# EAGLE design zerocam2S_revC (EAGLE 9.6.1)
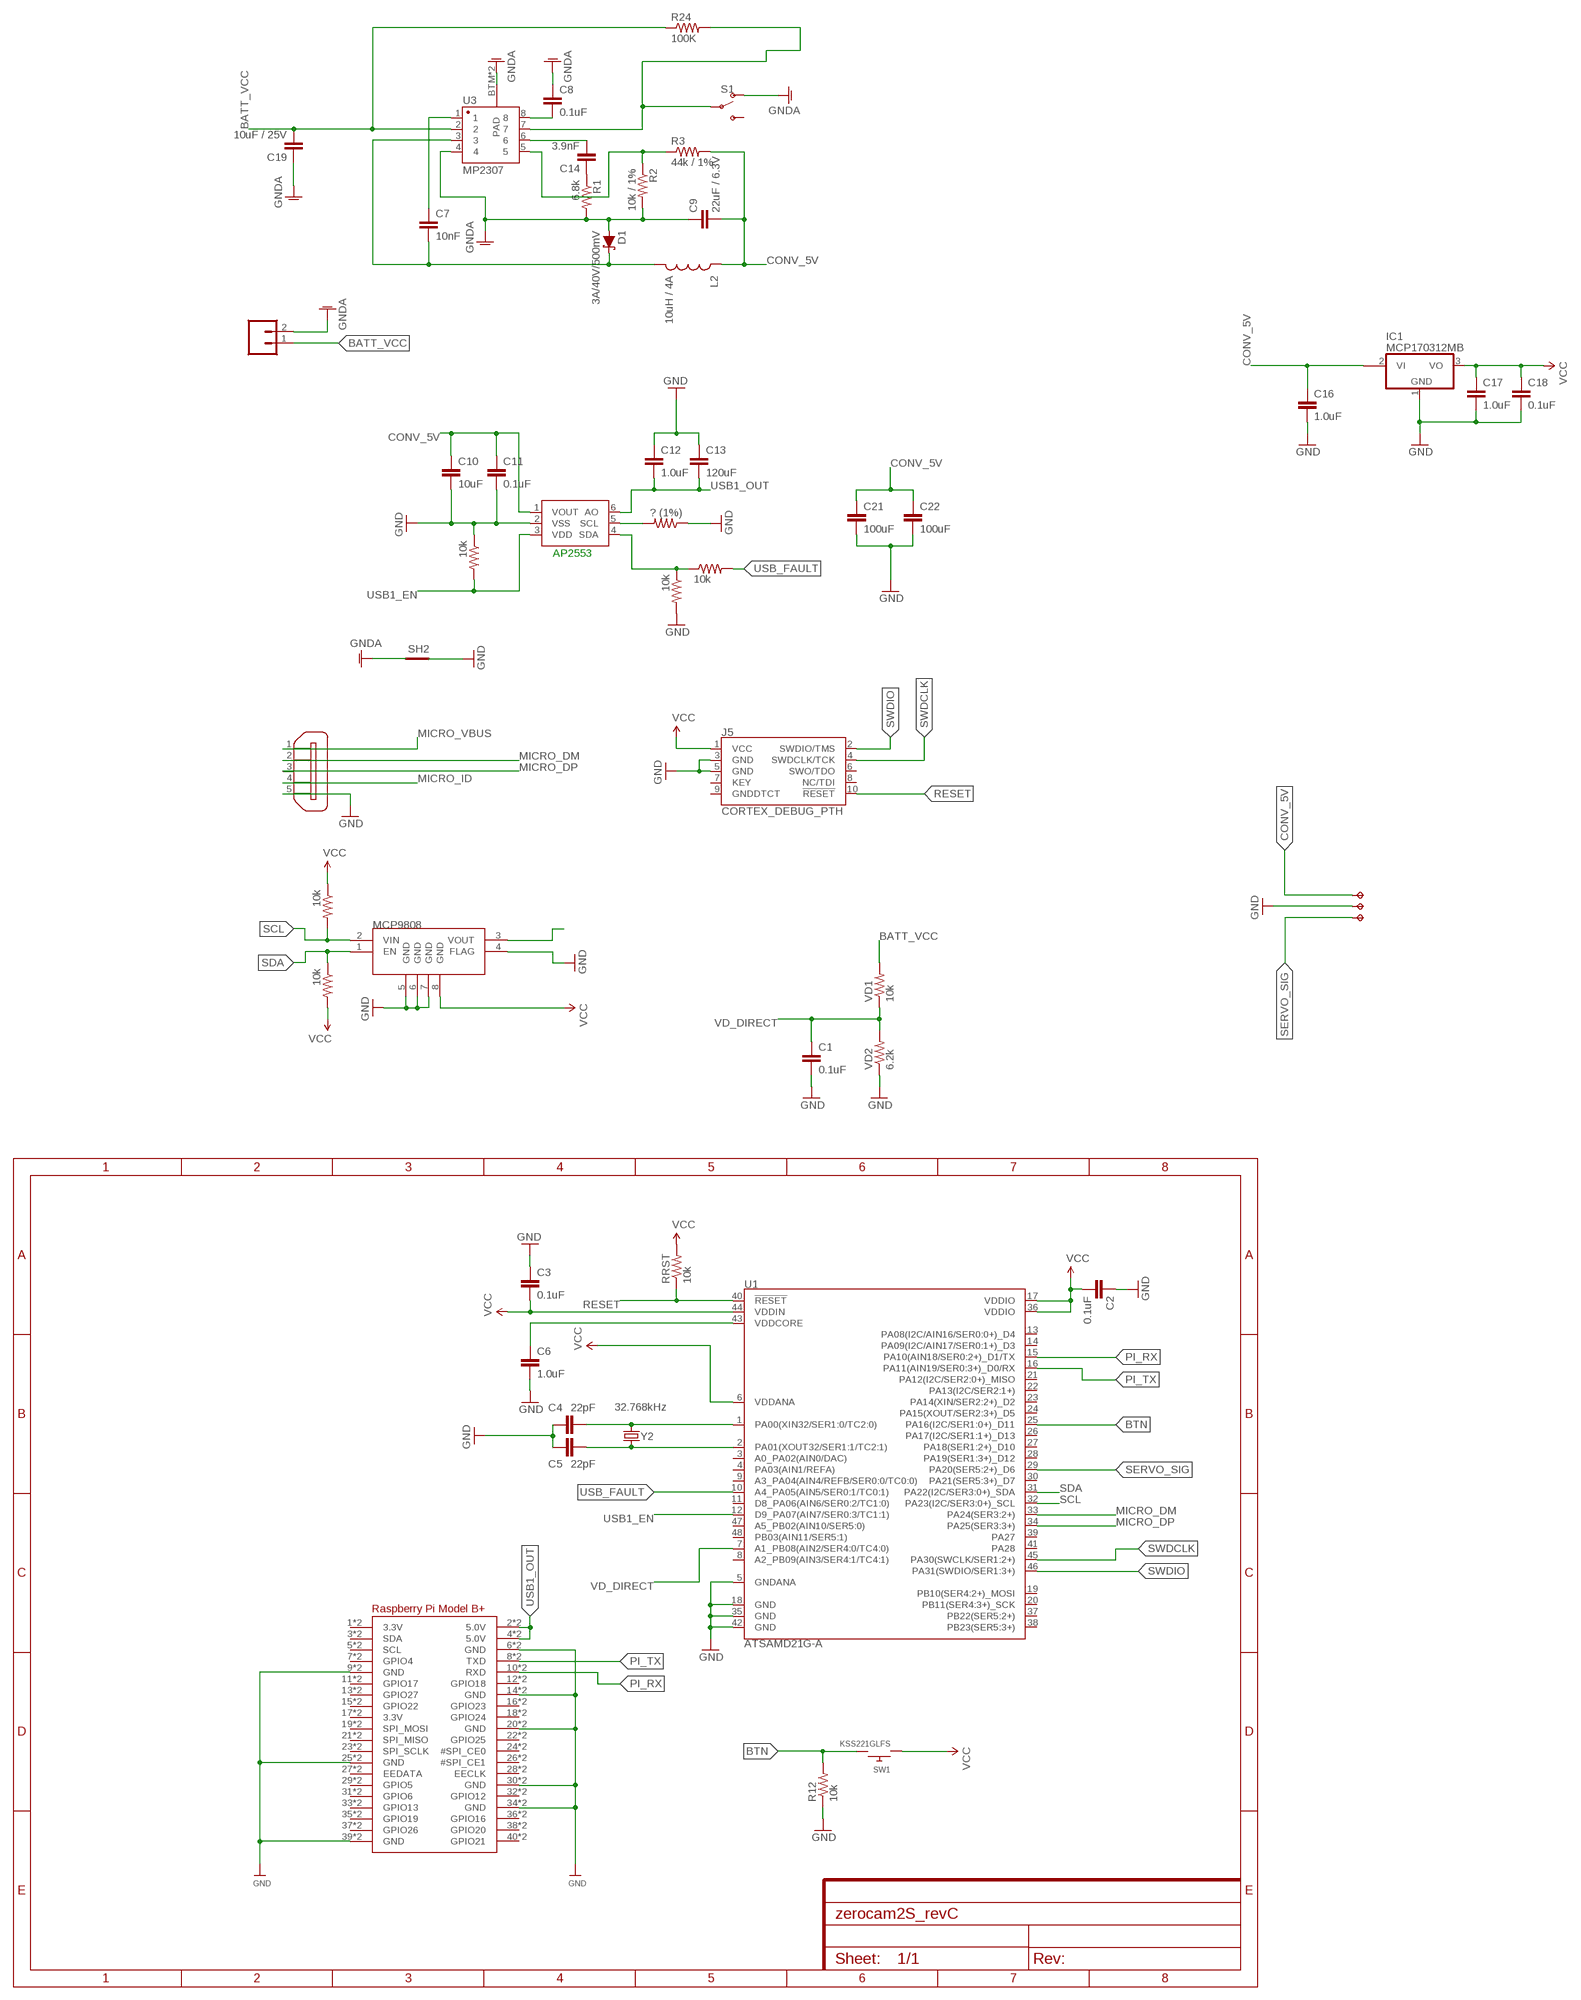
[diagram p0: schematic, sheet 1]

## Parts
AP2553  MCP4725  MCP4725SOT-23  [SOT23-6]
C1  0.1uF  CAP0805  [0805]
C2  0.1uF  1.0UF-0805-25V-10%  [0805]
C3  0.1uF  1.0UF-0805-25V-10%  [0805]
C4  22pF  CAP0805  [0805]
C5  22pF  CAP0805  [0805]
C6  1.0uF  1.0UF-0805-25V-10%  [0805]
C7  10nF  CAP0805  [0805]
C8  0.1uF  CAP1206  [1206]
C9  22uF / 6.3V  CAP1210  [1210]
C10  10uF  1.0UF-0805-25V-10%  [0805]
C11  0.1uF  1.0UF-0805-25V-10%  [0805]
C12  1.0uF  1.0UF-1206-50V-10%  [1206]
C13  120uF  1.0UF-1206-50V-10%  [1206]
C14  3.9nF  CAP1206  [1206]
C16  1.0uF  1.0UF-0805-25V-10%  [0805]
C17  1.0uF  1.0UF-1206-50V-10%  [1206]
C18  0.1uF  1.0UF-0805-25V-10%  [0805]
C19  10uF / 25V  CAP1210  [1210]
C21  100uF  10UF-1210-50V-20%  [1210]
C22  100uF  10UF-1210-50V-20%  [1210]
D1  3A/40V/500mV  DIODE-SCHOTTKY-B340A  [SMA-DIODE]
IC1  MCP170312MB  [SOT89]
J1  CONN_023.5MM-NO_SILK  [SCREWTERMINAL-3.5MM-2-NS]
J5  CORTEX_DEBUG_PTH  [2X5-PTH-1.27MM]
L2  10uH / 4A  INDUCTORSRU1038  [SRU1038]
MCP9808  V_REG_MIC5216  [MSOP8]
R1  6.8k  RESISTOR1206  [1206]
R2  10k / 1%  RESISTOR1206  [1206]
R3  44k / 1%  RESISTOR1206  [1206]
R12  10k  RESISTOR0805-RES  [0805]
R24  100K  RESISTOR1206  [1206]
R_I2C_1  10k  RESISTOR0805-RES  [0805]
R_I2C_2  10k  RESISTOR0805-RES  [0805]
R_MOSFET_USB1  ? (1%)  RESISTOR0805-RES  [0805]
R_MOSFET_USB2  10k  RESISTOR0805-RES  [0805]
R_MOSFET_USB3  10k  RESISTOR0805-RES  [0805]
R_MOSFET_USB4  10k  RESISTOR0805-RES  [0805]
RPI1  RASPBERRYPI_BPLUS_BONNET_THMSMT  [PI_BONNET_THMSMT]
RRST  10k  RESISTOR0805-RES  [0805]
S1  SWITCH-SPDT-SMD-RIGHT-ANGLE  [SWITCH_SPST_SMD_A]
SH2  SHORT-HT5  [SHORT_TOP-50]
SW1  KSS221GLFS  SWITCH_PUSHBUTTONC&K_KSS  [BTN_CK_KSS]
TP1  TPTP20SQ  [TP20SQ]
TP2  TPTP20SQ  [TP20SQ]
TP3  TPTP20SQ  [TP20SQ]
U1  ATSAMD21G-A  [TQFP-48]
U3  MP2307  GENERIC-SOIC8MSGEQ7N-FILTER  [SO08]
VD1  10k  RESISTOR0805-RES  [0805]
VD2  6.2k  RESISTOR0805-RES  [0805]
X2  ZX62D-B-5PA8  [ZX62D-B-5PA8]
Y2  32.768kHz  CRYSTAL3.2X1.5MM  [CRYSTAL-SMD-3.2X1.5MM]

## Nets
BATT_VCC: C19.2 J1.1 R24.1 U3.2 VD1.2
BTN: R12.2 SW1.P$2 U1.25(PA16(I2C/SER1:0+)_D11)
CONV_5V [power]: AP2553.1(VOUT) C9.2 C10.1 C11.1 C16.1 C21.1 C22.1 IC1.2@1(VI1) L2.1 R3.2 TP1.TP
GND: AP2553.2(VSS) C1.2 C2.1 C3.1 C4.1 C5.1 C6.2 C10.2 C11.2 C12.1 C13.1 C16.2 C17.2 C18.2 C21.2 C22.2 IC1.1(GND) J5.3(GND) J5.5(GND) MCP9808.4(FLAG) MCP9808.5(GND) MCP9808.6(GND) MCP9808.7(GND) R12.1 R_MOSFET_USB1.1 R_MOSFET_USB2.2 R_MOSFET_USB3.1 RPI1.6(GND) RPI1.9(GND) RPI1.14(GND) RPI1.20(GND) RPI1.25(GND) RPI1.30(GND) RPI1.34(GND) RPI1.39(GND) RPI1.S6(GND) RPI1.S9(GND) RPI1.S14(GND) RPI1.S20(GND) RPI1.S25(GND) RPI1.S30(GND) RPI1.S34(GND) RPI1.S39(GND) SH2.2 TP2.TP U1.5(GNDANA) U1.18(GND) U1.35(GND) U1.42(GND) VD2.1 X2.5
GNDA [power]: C8.1 C9.1 C19.1 D1.A J1.2 R1.2 R2.2 S1.1(O) SH2.1 U3.4 U3.BTM(PAD) U3.P$1(PAD)
MICRO_DM: U1.33(PA24(SER3:2+)) X2.2
MICRO_DP: U1.34(PA25(SER3:3+)) X2.3
MICRO_ID: X2.4
MICRO_VBUS: X2.1
N$1: C6.1 U1.43(VDDCORE)
N$3: AP2553.5(SCL) R_MOSFET_USB1.2
N$4: MCP9808.3(VOUT)
N$5: AP2553.4(SDA) R_MOSFET_USB2.1 R_MOSFET_USB4.1
N$8: C4.2 U1.1(PA00(XIN32/SER1:0/TC2:0)) Y2.P$2
N$25: C8.2 U3.8
N$26 [power]: C7.2 D1.C L2.2 U3.3
N$27: C7.1 U3.1
N$28: C14.1 R1.1
N$29: C14.2 U3.6
N$30: R2.1 R3.1 U3.5
N$32: C5.2 U1.2(PA01(XOUT32/SER1:1/TC2:1)) Y2.P$1
PB_BUCK_EN: R24.2 S1.2(P) U3.7
PI_RX: RPI1.10(RXD) RPI1.S10(RXD) U1.15(PA10(AIN18/SER0:2+)_D1/TX)
PI_TX: RPI1.8(TXD) RPI1.S8(TXD) U1.16(PA11(AIN19/SER0:3+)_D0/RX)
RESET: J5.10(!RESET) RRST.1 U1.40(!RESET!)
SCL: MCP9808.2(VIN) R_I2C_1.2 U1.32(PA23(I2C/SER3:0+)_SCL)
SDA: MCP9808.1(EN) R_I2C_2.1 U1.31(PA22(I2C/SER3:0+)_SDA)
SERVO_SIG: TP3.TP U1.29(PA20(SER5:2+)_D6)
SWDCLK: J5.4(SWDCLK/TCK) U1.45(PA30(SWCLK/SER1:2+))
SWDIO: J5.2(SWDIO/TMS) U1.46(PA31(SWDIO/SER1:3+))
USB1_EN: AP2553.3(VDD) R_MOSFET_USB3.2 U1.12(D9_PA07(AIN7/SER0:3/TC1:1))
USB1_OUT: AP2553.6(AO) C12.2 C13.2 RPI1.2(5.0V) RPI1.4(5.0V) RPI1.S2(5.0V) RPI1.S4(5.0V)
USB_FAULT: R_MOSFET_USB4.2 U1.10(A4_PA05(AIN5/SER0:1/TC0:1))
VCC [power]: C2.2 C3.2 C17.1 C18.1 IC1.3(VO) J5.1(VCC) MCP9808.8(GND) R_I2C_1.1 R_I2C_2.2 RRST.2 SW1.P$1 U1.6(VDDANA) U1.17(VDDIO) U1.36(VDDIO) U1.44(VDDIN)
VD_DIRECT: C1.1 U1.7(A1_PB08(AIN2/SER4:0/TC4:0)) VD1.1 VD2.2
Unconnected: IC1.2(VI) J5.6(SWO/TDO) J5.7(KEY) J5.8(NC/TDI) J5.9(GNDDTCT) RPI1.1(3.3V) RPI1.3(SDA) RPI1.5(SCL) RPI1.7(GPIO4) RPI1.11(GPIO17) RPI1.12(GPIO18) RPI1.13(GPIO27) RPI1.15(GPIO22) RPI1.16(GPIO23) RPI1.17(3.3V) RPI1.18(GPIO24) RPI1.19(SPI_MOSI) RPI1.21(SPI_MISO) RPI1.22(GPIO25) RPI1.23(SPI_SCLK) RPI1.24(#SPI_CE0) RPI1.26(#SPI_CE1) RPI1.27(EEDATA) RPI1.28(EECLK) RPI1.29(GPIO5) RPI1.31(GPIO6) RPI1.32(GPIO12) RPI1.33(GPIO13) RPI1.35(GPIO19) RPI1.36(GPIO16) RPI1.37(GPIO26) RPI1.38(GPIO20) RPI1.40(GPIO21) RPI1.S1(3.3V) RPI1.S3(SDA) RPI1.S5(SCL) RPI1.S7(GPIO4) RPI1.S11(GPIO17) RPI1.S12(GPIO18) RPI1.S13(GPIO27) RPI1.S15(GPIO22) RPI1.S16(GPIO23) RPI1.S17(3.3V) RPI1.S18(GPIO24) RPI1.S19(SPI_MOSI) RPI1.S21(SPI_MISO) RPI1.S22(GPIO25) RPI1.S23(SPI_SCLK) RPI1.S24(#SPI_CE0) RPI1.S26(#SPI_CE1) RPI1.S27(EEDATA) RPI1.S28(EECLK) RPI1.S29(GPIO5) RPI1.S31(GPIO6) RPI1.S32(GPIO12) RPI1.S33(GPIO13) RPI1.S35(GPIO19) RPI1.S36(GPIO16) RPI1.S37(GPIO26) RPI1.S38(GPIO20) RPI1.S40(GPIO21) S1.3(S) U1.3(A0_PA02(AIN0/DAC)) U1.4(PA03(AIN1/REFA)) U1.8(A2_PB09(AIN3/SER4:1/TC4:1)) U1.9(A3_PA04(AIN4/REFB/SER0:0/TC0:0)) U1.11(D8_PA06(AIN6/SER0:2/TC1:0)) U1.13(PA08(I2C/AIN16/SER0:0+)_D4) U1.14(PA09(I2C/AIN17/SER0:1+)_D3) U1.19(PB10(SER4:2+)_MOSI) U1.20(PB11(SER4:3+)_SCK) U1.21(PA12(I2C/SER2:0+)_MISO) U1.22(PA13(I2C/SER2:1+)) U1.23(PA14(XIN/SER2:2+)_D2) U1.24(PA15(XOUT/SER2:3+)_D5) U1.26(PA17(I2C/SER1:1+)_D13) U1.27(PA18(SER1:2+)_D10) U1.28(PA19(SER1:3+)_D12) U1.30(PA21(SER5:3+)_D7) U1.37(PB22(SER5:2+)) U1.38(PB23(SER5:3+)) U1.39(PA27) U1.41(PA28) U1.47(A5_PB02(AIN10/SER5:0)) U1.48(PB03(AIN11/SER5:1)) X2.S1 X2.S2 X2.S3 X2.S4

## Notes on the sheet
- AP2553

## Library data of the parts
AP2553 = SparkFun-IC-Conversion:MCP4725: MCP4725 DAC Microchip 12-bit I2C DAC, SOT23-6 Datasheet <https://cdn.sparkfun.com/datasheets/BreakoutBoards/MCP4725_2009.pdf> SparkFun Products SparkFun I2C DAC Breakout - MCP4725 <https://www.sparkfun.com/products/12918> (BOB-12918); PROD_ID: IC-08886
C1 C7-C9 C14 C19 = SparkFun-Capacitors:CAP: Capacitor Standard 0603 ceramic capacitor, and 0.1" leaded capacitor.
C2 C3 C10 C11 C18 = SparkFun-Capacitors:1.0UF: 1µF ceramic capacitors A capacitor is a passive two-terminal electrical component used to store electrical energy temporarily in an electric field.; PROD_ID: CAP-08064; VALUE: 1.0uF
C4 C5 = SparkFun-Passives:CAP: Capacitor Standard 0603 ceramic capacitor, and 0.1" leaded capacitor.
C6 C16 = SparkFun-Capacitors:1.0UF: 1µF ceramic capacitors A capacitor is a passive two-terminal electrical component used to store electrical energy temporarily in an electric field.; PROD_ID: CAP-08064
C12 C17 = SparkFun-Capacitors:1.0UF: 1µF ceramic capacitors A capacitor is a passive two-terminal electrical component used to store electrical energy temporarily in an electric field.; PROD_ID: CAP-09822
C13 = SparkFun-Capacitors:1.0UF: 1µF ceramic capacitors A capacitor is a passive two-terminal electrical component used to store electrical energy temporarily in an electric field.; PROD_ID: CAP-09822; VALUE: 1.0uF
C21 C22 = SparkFun-Capacitors:10UF: 10.0µF ceramic capacitors A capacitor is a passive two-terminal electrical component used to store electrical energy temporarily in an electric field.; PROD_ID: CAP-09824; VALUE: 10uF
D1 = SparkFun-DiscreteSemi:DIODE-SCHOTTKY: Schottky diode A Schottky diode is a semiconductor diode which has a low forward voltage drop and a very fast switching action.; PROD_ID: DIO-09886
IC1 = linear:MCP1703*: 250 mA, 16V, Low Quiescent Current LDO Regulator Source: http://ww1.microchip.com/downloads/en/DeviceDoc/22049b.pdf
J1 = SparkFun-Connectors:CONN_02: Multi connection point. Often used as Generic Header-pin footprint for 0.1 inch spaced/style header connections On any of the 0.1 inch spaced packages, you can populate with these: Break Away Headers - Straight <https://www.sparkfun.com/products/116> (PRT-00116) Break Away Male Headers - Right Angle <https://www.sparkfun.com/products/553> (PRT-00553) Female Headers <https://www.sparkfun.com/products/115> (PRT-00115) Break Away Headers - Machine Pin <https://www.sparkfun.com/products/117> (PRT-00117) Break Away Female Headers - Swiss Machine Pin <https://www.sparkfun.com/products/743> (PRT-00743) For SCREWTERMINALS and SPRING TERMINALS visit here: Screw Terimnals on SparkFun.com <https://www.sparkfun.com/search/results?term=Screw+Terminals> (5mm/3.5mm/2.54mm spacing) This device is also useful as a general connection point to wire up your design to another part of your project. Our various solder wires solder well into these plated through hole pads. Hook-Up Wire - Assortment (Stranded, 22 AWG) <https://www.sparkfun.com/products/11375> (PRT-11375) Hook-Up Wire - Assortment (Solid Core, 22 AWG) <https://www.sparkfun.com/products/11367> (PRT-11367) View the entire wire category on our website here <https://www.sparkfun.com/categories/141> Special notes: Molex polarized connector foot print use with: PRT-08233 with associated crimp pins and housings. 2.54_SCREWTERM for use with PRT-10571. 3.5mm Screw Terminal footprints for PRT-08084 5mm Screw Terminal footprints for use with PRT-08432; PROD_ID: CONN-08399
J5 = SparkFun-Connectors:CORTEX_DEBUG: Cortex Debug Connector - 10 pin Supports JTAG debug, Serial Wire debug, and Serial Wire Viewer. PTH and SMD connector options available. General Connector Information <http://infocenter.arm.com/help/topic/com.arm.doc.faqs/attached/13634/cortex_debug_connectors.pdf> Products: PTH Connector <http://www.digikey.com/product-detail/en/cnc-tech/3220-10-0100-00/1175-1627-ND/3883661> -via Digi-Key SparkFun PSoc <https://www.sparkfun.com/products/13229> SparkFun T <https://www.sparkfun.com/products/13810>
L2 = SparkFun-Passives:INDUCTOR: Inductors Basic Inductor/Choke - 0603 and 1206. Footprints are not proven and vary greatly between part numbers. INDUCTOR POWER 3.3UH 4.0A SMD 0.197" L x 0.197" W x 0.177" H (5.00mm x 5.00mm x 4.50mm)
MCP9808 = SparkFun-IC-Power:V_REG_MIC5216: 500mA LDO, MSOP8 for better dissipation; PROD_ID: IC-09527
R1-R3 R24 = SparkFun-Resistors:RESISTOR: Resistor Basic schematic elements and footprints for 0603, 1206, and PTH resistors.
R12 R_I2C_1 R_I2C_2 R_MOSFET_USB1-R_MOSFET_USB4 RRST VD1 VD2 = SparkFun-Passives:RESISTOR: Resistor Basic schematic elements and footprints for 0603, 1206, and PTH resistors.
RPI1 = microbuilder:RASPBERRYPI_BPLUS
S1 = SparkFun-Switches:SWITCH-SPDT: Single Pole, Double Throw (SPDT) Switch Single-pole, double-throw (SPDT) switch. Variant Overview SMD-AYZ0202 Surface Mount DPDT Switch <https://www.sparkfun.com/products/597> (COM-00597) Used on e.g. LilyPad Arduino USB - ATmega32U4 Board <https://www.sparkfun.com/products/12049> PTH-11.6X4.0MM SPDT Mini Power Switch <https://www.sparkfun.com/products/102> (COM-00102) Used on e.g. SparkFun Simon Says - Through-Hole Soldering Kit <https://www.sparkfun.com/products/10547> (KIT-10547) PTH-11.6X4.0MM-KIT KIT version of SPDT Mini Power Switch - Simplifies soldering by removing tStop of switch pins - only one side can be soldered. PTH-11.6X4.0MM-LOCK LOCK version of SPDT Mini Power Switch - Offset pins hold switch in place for easier soldering. SMD-RIGHT-ANGLE Surface Mount Right Angle Switch <https://www.sparkfun.com/products/10860> (COM-10860) Used on e.g. SparkFun ESP8266 Thing <https://www.sparkfun.com/products/13231>; PROD_ID: SWCH-10651; SF_SKU: COM-10860
SH2 = shorts:SHORT-H: Short between two nets; BOM: no
SW1 = adafruit:SWITCH_PUSHBUTTON: Buttons SOFTTOUCHSMD_SJ - Soft touch temporary push button (Super Junk Akihabara) Compatible with SKPMANE010 [Mouser: 688-SKPMAN] C&K_KSS = Digikey: KSS221GLFS
TP1-TP3 = testpad:TP: Test pad
U1 = SparkFun-IC-Microcontroller:ATSAMD21G: Atmel SAMD21G SMART ARM-Based Microcontroller The Atmel ® | SMART ™ SAM D21 is a series of low-power microcontrollers using the 32-bit ARM ® Cortex ® -M0+ processor, and ranging from 32- to 64-pins with up to 256KB Flash and 32KB of SRAM. The SAM D21 devices operate at a maximum frequency of 48MHz and reach 2.46 CoreMark/MHz. They are designed for simple and intuitive migration with identical peripheral modules, hex compatible code, identical linear address map and pin compatible migration paths between all devices in the product series. All devices include intelligent and flexible peripherals, Atmel Event System for inter-peripheral signaling, and support for capacitive touch button, slider and wheel user interfaces. Datasheet <https://cdn.sparkfun.com/datasheets/Dev/Arduino/Boards/Atmel-42181-SAM-D21_Datasheet.pdf> SparkFun Products SparkFun SAMD21 Mini Breakout <https://www.sparkfun.com/products/13664> (DEV-13664) SparkFun SAMD21 Dev Breakout <https://www.sparkfun.com/products/13672> (DEV-13672) (DEV-14926); PROD_ID: IC-13064
U3 = SparkFun-AnalogIC:GENERIC-SOIC8: A placeholder for generic narrow & wide SOIC8 foorptints - used on the DIP adapter board.; PROD_ID: IC-10141
X2 = zx62d-b-5pa8-oshpark_10:ZX62D-B-5PA8: Micro USB Type B Connector - Standard, Shell Through Hole Source: http://www.hirose.co.jp/cataloge_hp/ed_ZX_20140804.pdf; MF: Hirose; MPN: ZX62D-B-5PA8; OC_FARNELL: 2300438; OC_NEWARK: 69W0712
Y2 = samd21-temp:CRYSTAL: Various standard crystals. Proven footprints.; PROD_ID: XTAL-13062

## Net classes
1 power: width 0.254 mm, clearance 0.203 mm
2 hub_power: width 0.584 mm, clearance 0.254 mm
4 highpower: clearance 0.305 mm

## Board
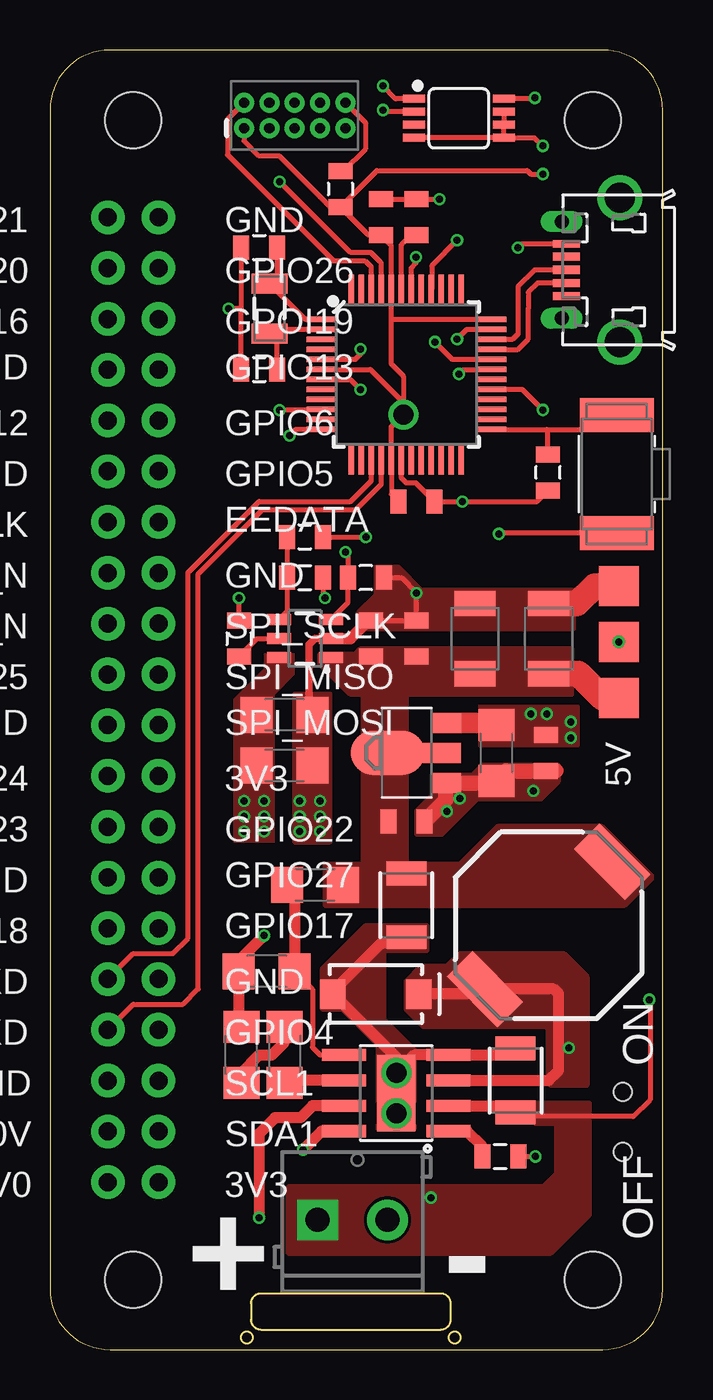
[diagram p1: board, top side]
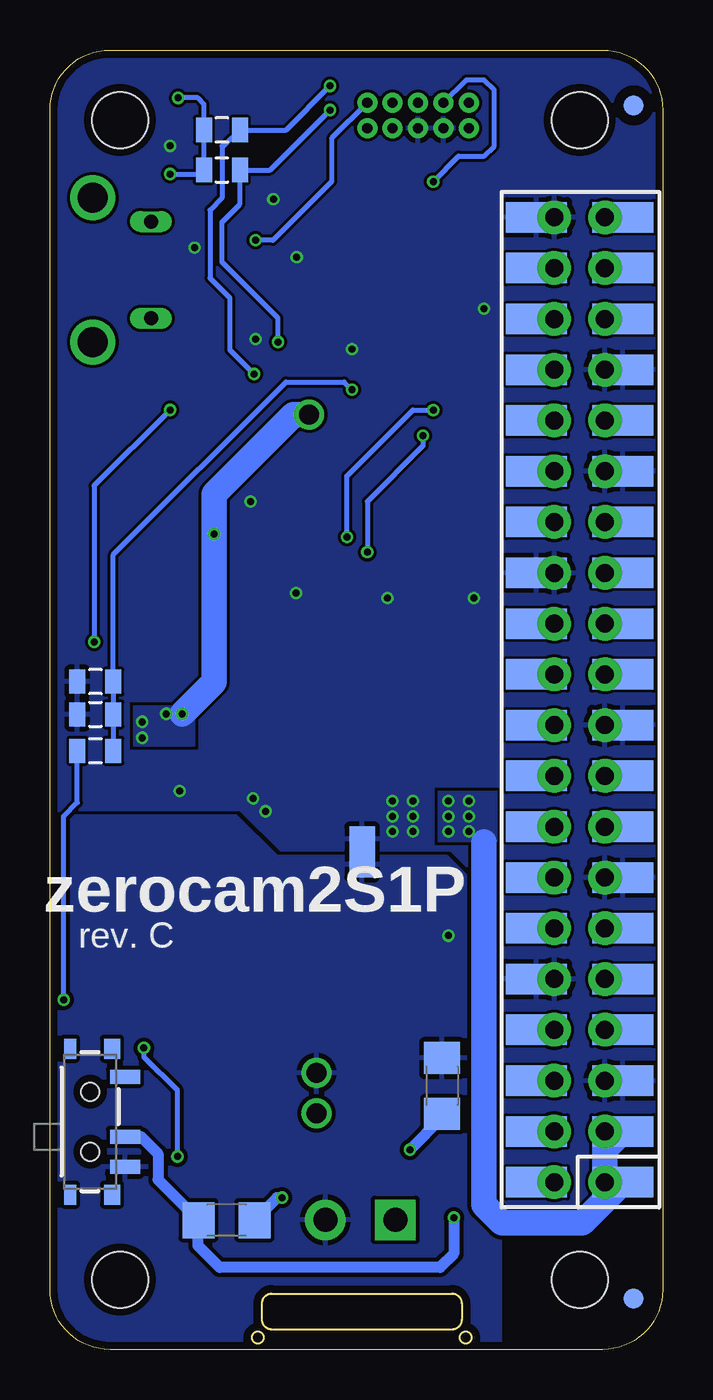
[diagram p2: board, bottom side, seen from below]

Size 30.66 x 65 mm. Coordinates in mm from the lower left corner, seen from the top.
Outline: 10.05,2.3 10.05,1.5 arc90 10.55,1 19.55,1 arc90 20.05,1.5 20.05,2.3 arc90 19.55,2.8 10.55,2.8 arc90 10.05,2.3
Outline: circle at 9.85,0.6 radius 0.28
Outline: circle at 20.25,0.6 radius 0.28
Copper layers (1*16): Top 0.035559375mm / dielectric 1.6mm / Bottom 0.035559375mm
Design rules "oshpark-2layer": minimum track width 6mil, minimum drill 10mil, track to track 6mil, track to pad 6mil, pad to pad 6mil, via to via 6mil, smd to smd 6mil, copper to edge 15mil, drill to drill 6mil, minimum pad ring 5mil, minimum via ring 5mil, stop-mask expansion 2.5mil, vias tented up to drill 0mil, thermal gap 10mil

### Footprints (pad centres in the part's own frame; a part is rotated, then mirrored left to right if it is on the bottom)
SOT23-6 = smd 0.55 x 1.2: 1 0.95,1.3; 2 0,1.3; 3 -0.95,1.3; 4 -0.95,-1.3; 5 0,-1.3; 6 0.95,-1.3
0805 = smd 0.8 x 1.2: 1 -0.9,0; 2 0.9,0
1206 = smd 1.6 x 1.8: 1 -1.4,0; 2 1.4,0
1210 = smd 1.2 x 2: 1 -1.6,0; 2 1.6,0
1210' = smd 1.27 x 2.06: 1 -1.755,0; 2 1.755,0
SMA-DIODE = smd 1.27 x 1.47: A -2.15,0; C 2.15,0
SOT89 = smd 1 x 1.5: 1 -1.499,-1.981; 3 1.499,-1.981 | smd 1 x 2: 2 0,-1.727 | smd 2.2 x 3.7: 2@1 0,0.94
SCREWTERMINAL-3.5MM-2-NS = drill 1.2 pad 2.032 square: 1 0,0 | drill 1.2 pad 2.032: 2 3.5,0
2X5-PTH-1.27MM = drill 0.508 pad 1: 1 -2.54,-0.635; 2 -2.54,0.635; 3 -1.27,-0.635; 4 -1.27,0.635; 5 0,-0.635; 6 0,0.635; 7 1.27,-0.635; 8 1.27,0.635; 9 2.54,-0.635; 10 2.54,0.635
SRU1038 = smd 1.8 x 3.6: 1 -4.5,0; 2 4.5,0
MSOP8 = smd 0.4 x 1.1: 1 -0.975,-2.25; 2 -0.325,-2.25; 3 0.325,-2.25; 4 0.975,-2.25; 5 0.975,2.25; 6 0.325,2.25; 7 -0.325,2.25; 8 -0.975,2.25
PI_BONNET_THMSMT = drill 0.9 pad 1.676: 1 8.37,25.23; 2 8.37,27.77; 3 10.91,25.23; 4 10.91,27.77; 5 13.45,25.23; 6 13.45,27.77; 7 15.99,25.23; 8 15.99,27.77; 9 18.53,25.23; 10 18.53,27.77; 11 21.07,25.23; 12 21.07,27.77; 13 23.61,25.23; 14 23.61,27.77; 15 26.15,25.23; 16 26.15,27.77; 17 28.69,25.23; 18 28.69,27.77; 19 31.23,25.23; 20 31.23,27.77; 21 33.77,25.23; 22 33.77,27.77; 23 36.31,25.23; 24 36.31,27.77; 25 38.85,25.23; 26 38.85,27.77; 27 41.39,25.23; 28 41.39,27.77; 29 43.93,25.23; 30 43.93,27.77; 31 46.47,25.23; 32 46.47,27.77; 33 49.01,25.23; 34 49.01,27.77; 35 51.55,25.23; 36 51.55,27.77; 37 54.09,25.23; 38 54.09,27.77; 39 56.63,25.23; 40 56.63,27.77 | smd 1 x 1 bottom: 41 2.54,29.21; 42 62.23,29.21 | smd 1.524 x 3.048 bottom: S1 8.37,24.339; S2 8.37,28.657; S3 10.91,24.339; S4 10.91,28.657; S5 13.45,24.339; S6 13.45,28.657; S7 15.99,24.339; S8 15.99,28.657; S9 18.53,24.339; S10 18.53,28.657; S11 21.07,24.339; S12 21.07,28.657; S13 23.61,24.339; S14 23.61,28.657; S15 26.15,24.339; S16 26.15,28.657; S17 28.69,24.339; S18 28.69,28.657; S19 31.23,24.339; S20 31.23,28.657; S21 33.77,24.339; S22 33.77,28.657; S23 36.31,24.339; S24 36.31,28.657; S25 38.85,24.339; S26 38.85,28.657; S27 41.39,24.339; S28 41.39,28.657; S29 43.93,24.339; S30 43.93,28.657; S31 46.47,24.339; S32 46.47,28.657; S33 49.01,24.339; S34 49.01,28.657; S35 51.55,24.339; S36 51.55,28.657; S37 54.09,24.339; S38 54.09,28.657; S39 56.63,24.339; S40 56.63,28.657 | hole 2.8: 3.5,26.5; 61.5,26.5; 61.5,3.5; 3.5,3.5
SWITCH_SPST_SMD_A = smd 0.7 x 1.5: 1 -2.25,-1.75; 2 -0.75,-1.75; 3 2.25,-1.75 | smd 1 x 0.6: GND1 -3.65,1; GND3 3.65,1 | smd 1 x 0.8: GND2 -3.65,-1.1; GND4 3.65,-1.1 | hole 0.9: -1.5,0; 1.5,0
SHORT_TOP-50 = smd 1.27 x 1.27: 1 0.635,0; 2 -0.635,0
BTN_CK_KSS = smd 1.7 x 3.7: P$1 -2.95,0; P$2 2.95,0
TP20SQ = smd 2 x 2: TP 0,0
TQFP-48 = smd 1.5 x 0.28: 1 -4.25,2.75; 2 -4.25,2.25; 3 -4.25,1.75; 4 -4.25,1.25; 5 -4.25,0.75; 6 -4.25,0.25; 7 -4.25,-0.25; 8 -4.25,-0.75; 9 -4.25,-1.25; 10 -4.25,-1.75; 11 -4.25,-2.25; 12 -4.25,-2.75; 25 4.25,-2.75; 26 4.25,-2.25; 27 4.25,-1.75; 28 4.25,-1.25; 29 4.25,-0.75; 30 4.25,-0.25; 31 4.25,0.25; 32 4.25,0.75; 33 4.25,1.25; 34 4.25,1.75; 35 4.25,2.25; 36 4.25,2.75 | smd 0.28 x 1.5: 13 -2.75,-4.25; 14 -2.25,-4.25; 15 -1.75,-4.25; 16 -1.25,-4.25; 17 -0.75,-4.25; 18 -0.25,-4.25; 19 0.25,-4.25; 20 0.75,-4.25; 21 1.25,-4.25; 22 1.75,-4.25; 23 2.25,-4.25; 24 2.75,-4.25; 37 2.75,4.25; 38 2.25,4.25; 39 1.75,4.25; 40 1.25,4.25; 41 0.75,4.25; 42 0.25,4.25; 43 -0.25,4.25; 44 -0.75,4.25; 45 -1.25,4.25; 46 -1.75,4.25; 47 -2.25,4.25; 48 -2.75,4.25
SO08 = smd 0.61 x 2.21: 1 -1.905,-2.616; 2 -0.635,-2.616; 3 0.635,-2.616; 4 1.905,-2.616; 5 1.905,2.616; 6 0.635,2.616; 7 -0.635,2.616; 8 -1.905,2.616 | smd 3.81 x 1.93: BTM 0,0 | drill 1: P$1 1.016,0; P$2 -1.016,0
ZX62D-B-5PA8 = smd 1.35 x 0.4: 1 4.825,1.3; 2 4.825,0.65; 3 4.825,0; 4 4.825,-0.65; 5 4.825,-1.3 | drill 1.5: S1 2.15,-3.6; S2 2.15,3.6 | drill 0.7 long: S3 5.05,2.425; S4 5.05,-2.425
CRYSTAL-SMD-3.2X1.5MM = smd 1 x 1.8: P$1 -1.25,0; P$2 1.25,0

### Placement (x,y rotation side)
AP2553  12.75,35.56 270 top
C1  28.39,33.4 180 bottom
C2  18.34,42.42 180 top
C3  16.56,56.64 270 top
C4  10.47,55.12 0 top
C5  10.47,49.02 0 top
C6  18.34,56.64 90 top
C7  22.53,9.65 0 top
C8  11.04,13.18 270 bottom
C9  17.83,22.23 90 top
C10  18.34,35.56 90 top
C11  16.06,35.56 90 top
C12  11.74,29.21 180 top
C13  11.74,31.75 180 top
C14  11.74,14.73 270 top
C16  17.83,26.42 0 top
C17  22.33,29.84 270 top
C18  24.82,29.84 270 top
C19  23.29,13.46 270 top
C21  100uF  [1210']  21.26,35.56 90 top
C22  100uF  [1210']  24.95,35.56 90 top
D1  16.31,17.78 0 top
IC1  17.83,29.84 90 top
J1  13.39,6.48 0 top
J5  12.25,61.72 0 top
L2  24.95,21.21 225 top
MCP9808  20.45,61.58 270 top
R1  9.58,14.73 90 top
R2  10.85,18.92 180 top
R3  13.26,23.24 0 top
R12  24.92,43.86 90 top
R24  21.83,6.47 180 bottom
R_I2C_1  22.05,59 0 bottom
R_I2C_2  22.05,61 180 bottom
R_MOSFET_USB1  9.45,35.56 270 top
R_MOSFET_USB2  12.75,38.61 0 top
R_MOSFET_USB3  15.8,38.61 180 top
R_MOSFET_USB4  12.75,40.64 0 top
RPI1  30.66,0 90 top
RRST  14.53,58.04 270 top
S1  28.65,11.4 90 bottom
SH2  15.04,24.89 270 bottom
SW1  28.35,43.8 90 top
TP1  28.45,32.6 0 top
TP2  28.45,38.2 0 top
TP3  28.45,35.4 0 top
U1  17.83,48.77 0 top
U3  17.33,12.83 90 top
VD1  28.39,29.94 180 bottom
VD2  28.39,31.77 0 bottom
X2  30.66,54 180 top
Y2  10.98,52.07 90 top

### Tracks (layer width: path | path; a pad name or v marks a point on that pad's centre or on a via)
BATT_VCC  (via drill 0.35)
  Top 0.254: C19.2 23.49,11.66 29.19,11.66 30.03,12.5 30.03,17.45 v29.98,17.5
  Top 0.559: U3.2 22.96,12.19 C19.2
  Bottom 0.254: v29.98,17.5 29.98,26.67 29.29,27.35 VD1.2
  Bottom 0.558: J1.1 13.05,6.82 | R24.1 19.31,7.6 v19.05,7.6
  pour Top (no thermals): 11.92,4.81 25.06,4.81 26.98,6.73 26.98,12.32 24.18,12.32 24.18,11.43 24.31,11.3 25.33,11.3 25.33,8.76 24.69,8.13 11.92,8.13
BTN
  Top 0.254: 26.91,46.75 SW1.P$2 27.62,46.02 24.85,46.02 | U1.25 24.85,46.02 | R12.2 24.92,45.95 24.85,46.02
CONV_5V
  Top 1.27: TP1.TP 27.65,32.6 26.45,33.8 C22.1
  pour Top (no thermals): 13.77,22.23 28.76,22.23 30.15,23.62 27.61,26.16 22.41,26.16 20.5,24.26 13.77,24.26
  pour Top (no thermals): 13.52,34.8 15.29,34.8 15.55,35.05 26.09,35.05 26.09,32.77 15.04,32.77 13.52,34.29
  pour Top (no thermals): 17.83,23.62 17.83,33.02 15.67,33.02 15.67,23.5 17.83,23.5
GND  (via drill 0.35)
  Top 0.254: U1.18 17.58,43.6 17.83,43.35 18.31,43.35 C2.1 v20.63,42.42 24.38,42.42 R12.1 | C11.2 C10.2 v18.34,37.85 17.58,38.61 R_MOSFET_USB3.1 | R_MOSFET_USB1.1 v9.45,37.59 | C3.1 C6.2 19.47,57.54 v19.48,57.53 | U1.42 18.08,54.1 18.31,54.33 v18.31,54.64 | U1.35 20.85,51.02 v20.37,50.55 | C4.1 9.57,52.07 | 9.57,52.07 v8.94,52.07 | C5.1 9.57,52.07 | U1.5 13.6,49.53 15.29,49.53 15.55,49.78 v15.55,50.04 | R_MOSFET_USB2.2 13.65,37.71 v13.77,37.59 | 25.32,28.95 C18.2 | X2.5 23.6,55.3 v23.42,55.12 | MCP9808.5 MCP9808.6 MCP9808.7 | MCP9808.5 MCP9808.4 | MCP9808.5 24.25,60.6 v24.65,60.2
  Top 0.381: AP2553.2 13.26,35.56 12.96,35.26 12.96,31.93 C13.1
  Top 0.559: AP2553.2 15.04,35.56 15.94,36.46 C11.2
  Top 0.762: C16.2 19.81,27.5 IC1.1 22.23,28.35 C17.2 22.83,28.95 25.32,28.95
  Top 1.27: TP2.TP 27.25,38.2 26.37,37.31 C22.2
  other vias: 12.5,27.43 13.52,27.43 12.5,26.67 12.5,25.91 13.52,25.91 13.52,26.67 19.87,26.92 20.5,27.56 24.18,27.94
  pour Bottom (rank 2): 0.05,0 31.05,0 31.05,65 0.05,65
  pour Top (no thermals): 12.25,32.77 12.25,25.4 14.02,25.4 14.02,32.77
  pour Top (no thermals): 18.34,25.78 19.61,25.78 21.39,27.56 24.56,27.56 25.45,28.45 25.45,29.21 21.64,29.21 21.14,28.7 19.1,28.7 19.1,27.69 18.34,26.92
  pour Top (no thermals): 15.42,36.07 26.22,36.07 26.22,37.97 18.6,37.97 17.45,39.12 16.31,39.12 16.31,37.72 15.42,36.83
GNDA  (via drill 0.35)
  Top 0.559: C19.1 22.96,14.73 U3.4 18.21,14.73 U3.P$1 | C9.1 17.53,20.32 16.56,20.32 14.16,17.92 D1.A 17.33,14.61 U3.BTM | R1.2 9.45,16.26 R2.2 9.45,19.43 v10.72,20.7
  pour Bottom: 7.67,0 31.05,0 31.05,26.67 21.39,26.67 19.36,24.64 10.85,24.64 8.18,21.97 8.18,0.51
  pour Top (no thermals): 18.21,11.05 16.44,11.05 16.44,15.24 14.66,17.02 13.64,17.02 13.64,19.05 15.8,21.21 18.85,21.21 18.85,19.94 16.69,19.94 16.69,16.51 18.21,14.99
MICRO_DM
  Top 0.254: U1.33 23.4,50.02 23.93,50.55 23.93,52 23.93,52.07 23.93,52.88 24.4,53.35 X2.2
MICRO_DP
  Top 0.254: U1.34 22.11,50.55 23.17,50.55 23.42,50.8 23.42,53.17 24.25,54 X2.3
N$1
  Top 0.254: U1.43 17.58,55.26 17.6,55.25 18.09,55.74 C6.1
N$3
  Top 0.254: R_MOSFET_USB1.2 10.35,35.56 AP2553.5
N$5
  Top 0.254: R_MOSFET_USB4.1 R_MOSFET_USB2.1 11.85,36.91 AP2553.4
N$8
  Top 0.254: U1.1 12.78,51.52 Y2.P$2 11.37,53.71 C4.2
N$25  (via drill 0.35)
  Top 0.558: U3.8 13.58,10.92 v12.65,10
  Bottom 0.558: v12.65,10 11.04,11.61 C8.2
N$26  (via drill 0.35)
  Top 0.254: C7.2 v24.28,9.65
  Top 0.559: U3.3 24.95,13.46 25.45,13.97 25.45,17.78 25.21,18.03 L2.2 21.52,17.78 D1.C
  Bottom 0.254: v25.96,15.08 25.96,14.63 24.28,12.95 v24.28,9.65
  pour Top (no thermals): 18.72,16.13 17.83,17.02 17.83,18.41 18.6,19.18 18.72,19.18 19.87,19.18 20.5,19.81 25.71,19.81 26.85,18.67 26.85,13.21 25.07,13.21 24.95,13.34 24.95,16.26 24.82,16.13 22.28,16.13
N$27
  Top 0.559: U3.1 20.87,10.92 21.63,10.16 C7.1
N$28
  Top 0.559: R1.1 9.58,13.84 10.47,14.73 11.1,14.73 11.74,15.37 C14.1
N$29
  Top 0.559: U3.6 11.87,13.46 C14.2
N$30
  Top 0.254: R2.1 13.13,18.04 13.13,15.11 13.52,14.73 U3.5
  Top 0.559: R3.1 12.25,22.85 R2.1
N$32
  Top 0.254: C5.2 11.37,50.43 Y2.P$1 10.98,50.8 11.19,51.02 11.37,50.84 11.54,51.02 U1.2
PB_BUCK_EN  (via drill 0.35)
  Top 0.558: 12.75,11.81 12.54,11.6 11.25,11.6 10.45,10.8 v10.45,6.6
  Top 0.559: U3.7 13.13,12.19 12.75,11.81
  Bottom 0.558: S1.2 26.1,10.65 25.25,9.8 25.25,8.5 R24.2 23.25,6.45 23.25,5.2 22.16,4.11 11.14,4.11 10.45,4.8 v10.45,6.6
PI_RX
  Top 0.254: U1.15 16.08,43.46 15.04,42.42 10.47,42.42 6.91,38.86 6.91,20.57 6.15,19.81 4.17,19.81 RPI1.10 2.88,18.54
  Bottom 0.254: RPI1.S10 | RPI1.S10 RPI1.10
PI_TX
  Top 0.254: RPI1.8 4.17,17.27 6.66,17.27 7.42,18.03 7.42,38.8 10.64,42.01 15.31,42.01 16.58,43.28 U1.16
  Bottom 0.254: RPI1.S8 | RPI1.S8 RPI1.8
RESET  (via drill 0.35)
  Top 0.254: U1.40 19.1,53.04 19.1,54.21 v20.37,55.48 | RRST.1 14.67,58.94 15.8,60.07 15.8,61.34 J5.10
  Bottom 0.254: J5.10 16.56,60.58 16.56,58.42 19.5,55.48 v20.37,55.48
SCL  (via drill 0.35)
  Top 0.254: 22.1,49.53 U1.32 20.14,49.52 v19.25,50.4 | MCP9808.2 16.75,61.91 v16.65,62
  Bottom 0.254: v19.25,50.4 19.25,51.6 22.05,54.4 22.05,56.4 21.15,57.3 R_I2C_1.2 19.65,59 v16.65,62
SDA  (via drill 0.35)
  Top 0.254: U1.31 22.07,49 20.65,49 v20.45,48.8 | MCP9808.1 17.3,62.55 v16.65,63.2
  Bottom 0.254: v20.45,48.8 21.65,50 21.65,52.6 22.65,53.6 22.65,57 22.05,57.6 22.05,60.2 21.95,60.2 R_I2C_2.1 18.85,61 v16.65,63.2
SERVO_SIG  (via drill 0.35)
  Top 0.254: v24.65,47 23.64,48.02 U1.29
  Bottom 0.254: TP3.TP 28.45,43.2 v24.65,47
  other vias: 28.45,35.4
SWDCLK  (via drill 0.35)
  Top 0.254: U1.45 16.56,53.04 16.56,54.36 16.06,54.86 15.04,54.86 v11.48,58.42
  Bottom 0.254: v11.48,58.42 10.21,59.69 8.94,59.69 8.44,60.2 8.44,62.99 8.94,63.5 9.83,63.5 J5.4
SWDIO
  Top 0.254: U1.46 16.08,54.13 15.76,54.46 14.18,54.46 8.88,59.76 8.88,61.53 J5.2
USB1_EN  (via drill 0.35)
  Top 0.254: AP2553.3 14.9,37.36 R_MOSFET_USB3.2 14.9,39.76 v14.79,39.88 | U1.12 12.29,46.02 v11.99,45.72
  Bottom 0.254: v11.99,45.72 11.99,45.21 14.79,42.42 v14.79,39.88
USB1_OUT  (via drill 0.35)
  Bottom 0.254: RPI1.S2 | RPI1.S2 RPI1.2 | RPI1.S4 | RPI1.S4 RPI1.4
  Bottom 1.27: RPI1.S4 2.89,10.02 RPI1.2 | RPI1.S2 4.02,6.35 8.05,6.35 8.94,7.24 8.94,25.4
  other vias: 9.71,27.43 10.72,27.43 10.72,26.67 9.71,26.67 9.71,25.91 10.72,25.91
  pour Top (no thermals): 10.72,34.8 10.72,34.04 9.2,32.51 9.2,26.42 9.2,25.4 11.23,25.4 11.23,32.51 11.23,32.77 12.25,33.78 12.25,34.8
  pour Bottom: 11.23,27.94 8.31,27.94 8.31,25.4 11.23,25.4
USB_FAULT  (via drill 0.35)
  Top 0.254: R_MOSFET_USB4.2 v15.8,40.64 | v11.48,46.99 11.51,47.02 U1.10
  Bottom 0.254: v15.8,40.64 15.8,43.69 12.5,46.99 v11.48,46.99
VCC  (via drill 0.35, 1)
  Top 0.254: C2.2 17.08,42.78 U1.17 17.08,46.16 v17.69,46.77 | 17.07,51.56 17.07,53.01 U1.44 17.08,55.22 C3.2 15.93,55.74 RRST.2 | U1.36 17.12,51.52 17.07,51.56 | U1.6 16.04,49.02 17.69,47.37 v17.69,46.77 | 17.07,51.56 17.07,49.31 17.69,48.69 v17.69,46.77 | J5.1 9.71,60.45 10.47,59.69 11.48,59.69 14.03,57.14 RRST.2 | RRST.2 16.36,58.97 23.89,58.97 24.05,58.8 v24.65,58.8 | 22.83,30.75 C17.1 | v24.25,62.6 24.21,62.55 MCP9808.8 | 28.05,40.55 SW1.P$1 22.5,40.85 v22.45,40.8
  Top 1.016: IC1.3 22.23,31.34 C17.1
  Bottom 0.254: v24.25,62.6 23.25,62.6 22.95,62.3 R_I2C_2.2 R_I2C_1.1 23.15,58.8 v24.65,58.8
  Bottom 1.27: v24.05,31.8 22.45,33.4 v22.45,40.8 22.45,42.8 18.49,46.77 v17.69,46.77
  other vias: 24.85,31.8 26.05,31.4 26.05,30.6
  pour Top (no thermals): 21.45,32.2 21.45,30.2 26.45,30.2 26.45,32.2
  pour Bottom: 26.45,30.2 26.45,32.2 23.45,32.2 23.45,30.2
VD_DIRECT  (via drill 0.35)
  Top 0.254: U1.7 15.04,48.52 v15.55,48.01
  Bottom 0.254: VD1.1 VD2.2 C1.1 27.49,39.76 18.85,48.4 15.94,48.4 v15.55,48.01

### Text on the board
tPlace: 5V | ON | OFF | + | -
bPlace: zerocam2S1P | rev. C